# EAGLE design temp (EAGLE 7.2.0)
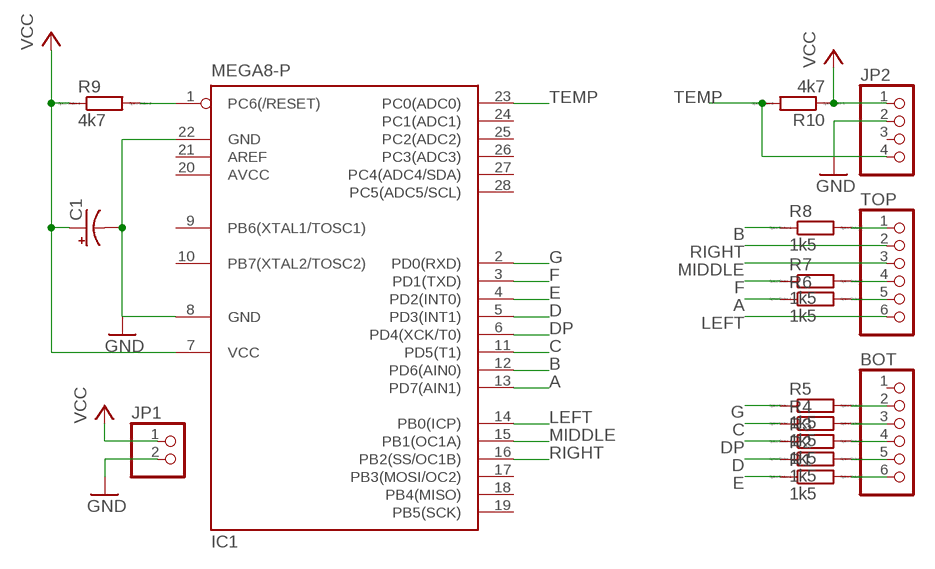
[diagram p0: schematic, sheet 1]

## Parts
BOT  PINHD-1X6  [1X06]
C1  CPOL-US153CLV-0505  [153CLV-0505]
IC1  MEGA8-P  [DIL28-3]
JP1  PINHD-1X2  [1X02]
JP2  PINHD-1X4  [1X04]
R1  1k5  R-EU_R1206  [R1206]
R2  1k5  R-EU_R1206  [R1206]
R3  1k5  R-EU_R1206  [R1206]
R4  1k5  R-EU_R1206  [R1206]
R5  1k5  R-EU_R1206  [R1206]
R6  1k5  R-EU_R1206  [R1206]
R7  1k5  R-EU_R1206  [R1206]
R8  1k5  R-EU_R1206  [R1206]
R9  4k7  R-EU_R1206  [R1206]
R10  4k7  R-EU_R1206  [R1206]
TOP  PINHD-1X6  [1X06]

## Nets
A: IC1.13(PD7(AIN1)) R6.1
B: IC1.12(PD6(AIN0)) R8.1
C: IC1.11(PD5(T1)) R4.1
D: IC1.5(PD3(INT1)) R2.1
DP: IC1.6(PD4(XCK/T0)) R3.1
E: IC1.4(PD2(INT0)) R1.1
F: IC1.3(PD1(TXD)) R7.1
G: IC1.2(PD0(RXD)) R5.1
GND: C1.- IC1.8(GND) IC1.22(GND) JP1.2 JP2.2
LEFT: IC1.14(PB0(ICP)) TOP.6
MIDDLE: IC1.15(PB1(OC1A)) TOP.3
N$1: R8.2 TOP.1
N$2: R7.2 TOP.4
N$3: R6.2 TOP.5
N$4: BOT.2 R5.2
N$5: BOT.3 R4.2
N$6: BOT.4 R3.2
N$7: BOT.5 R2.2
N$8: BOT.6 R1.2
N$9: IC1.1(PC6(/RESET)) R9.2
RIGHT: IC1.16(PB2(SS/OC1B)) TOP.2
TEMP: IC1.23(PC0(ADC0)) JP2.4 R10.2
VCC: C1.+ IC1.7(VCC) JP1.1 JP2.1 R9.1 R10.1
Unconnected: BOT.1 IC1.9(PB6(XTAL1/TOSC1)) IC1.10(PB7(XTAL2/TOSC2)) IC1.17(PB3(MOSI/OC2)) IC1.18(PB4(MISO)) IC1.19(PB5(SCK)) IC1.21(AREF) IC1.24(PC1(ADC1)) IC1.25(PC2(ADC2)) IC1.26(PC3(ADC3)) IC1.27(PC4(ADC4/SDA)) IC1.28(PC5(ADC5/SCL)) JP2.3

## Power pins joined to a net without a drawn wire
AVCC: IC1.20(AVCC)

## Library data of the parts
BOT TOP = pinhead:PINHD-1X6: PIN HEADER
C1 = rcl:CPOL-US: POLARIZED CAPACITOR, American symbol
IC1 = atmel:MEGA8-P: MICROCONTROLLER 8 Kbytes FLASH, 1 kbytes SRAM, 512 bytes EEPROM, USART, 4-channel 10 bit ADC, 2-channel 8 bit ADC Pin compatible with Atmega48, ATMega88, ATMega168 Source: avr.lbr; OC_FARNELL: unknown; OC_NEWARK: unknown
JP1 = pinhead:PINHD-1X2: PIN HEADER
JP2 = pinhead:PINHD-1X4: PIN HEADER
R1-R10 = resistor:R-EU_: RESISTOR, European symbol; SPICEPREFIX: R

## Board
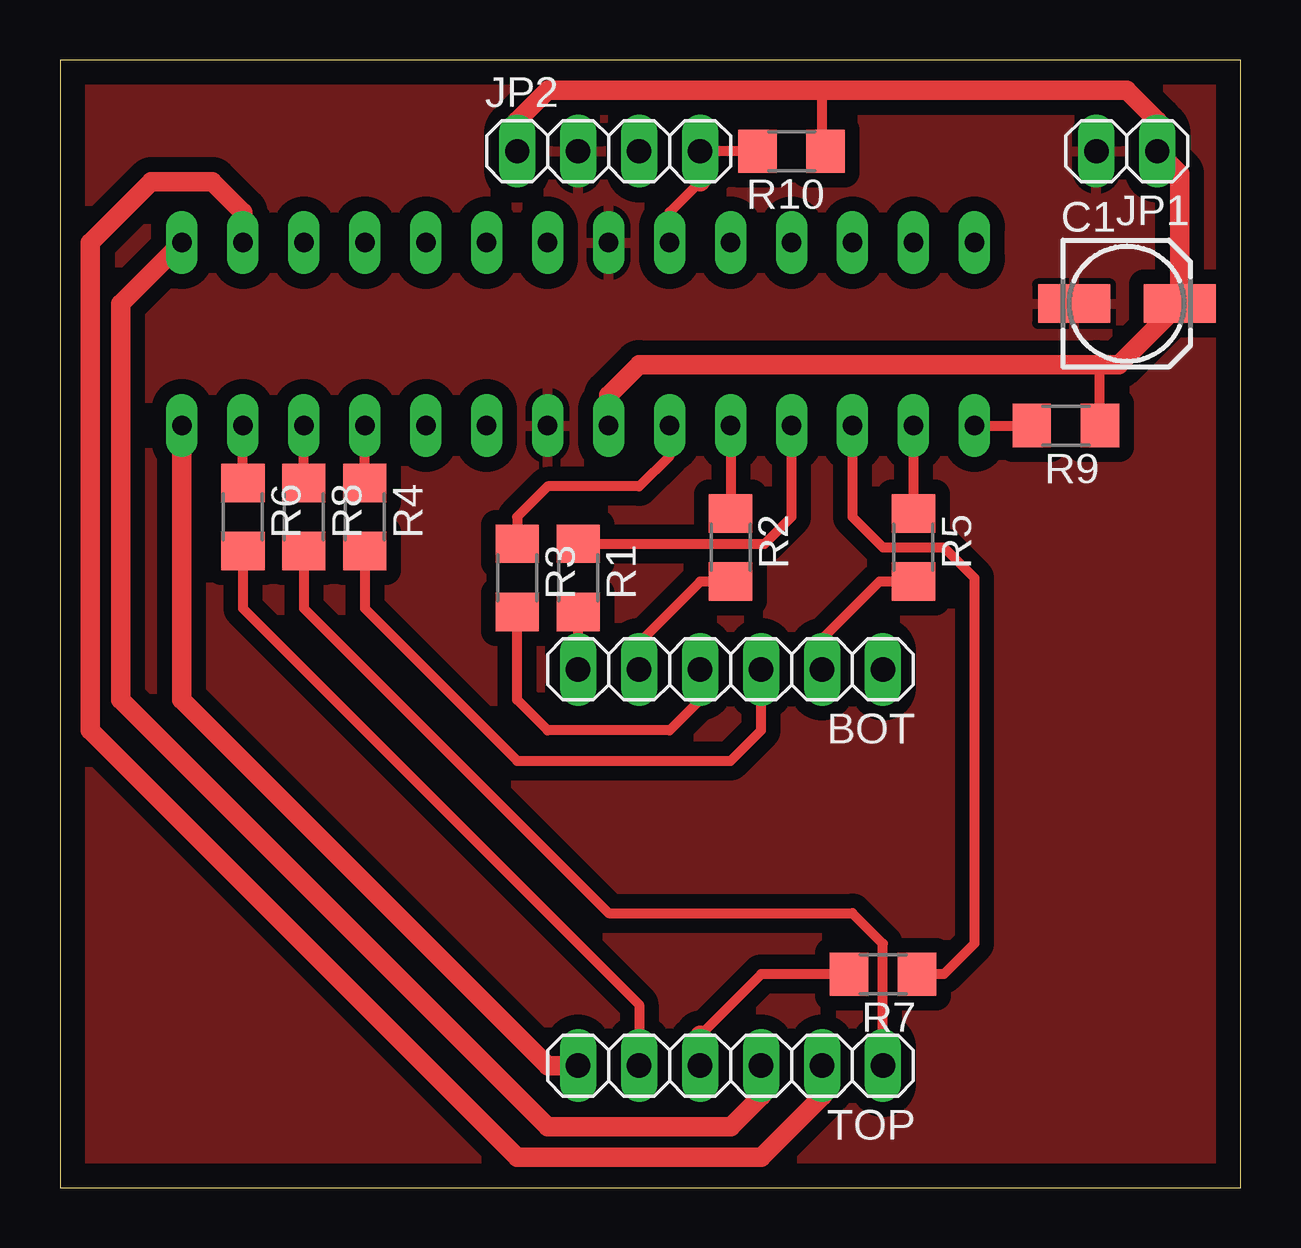
[diagram p1: board, top side]
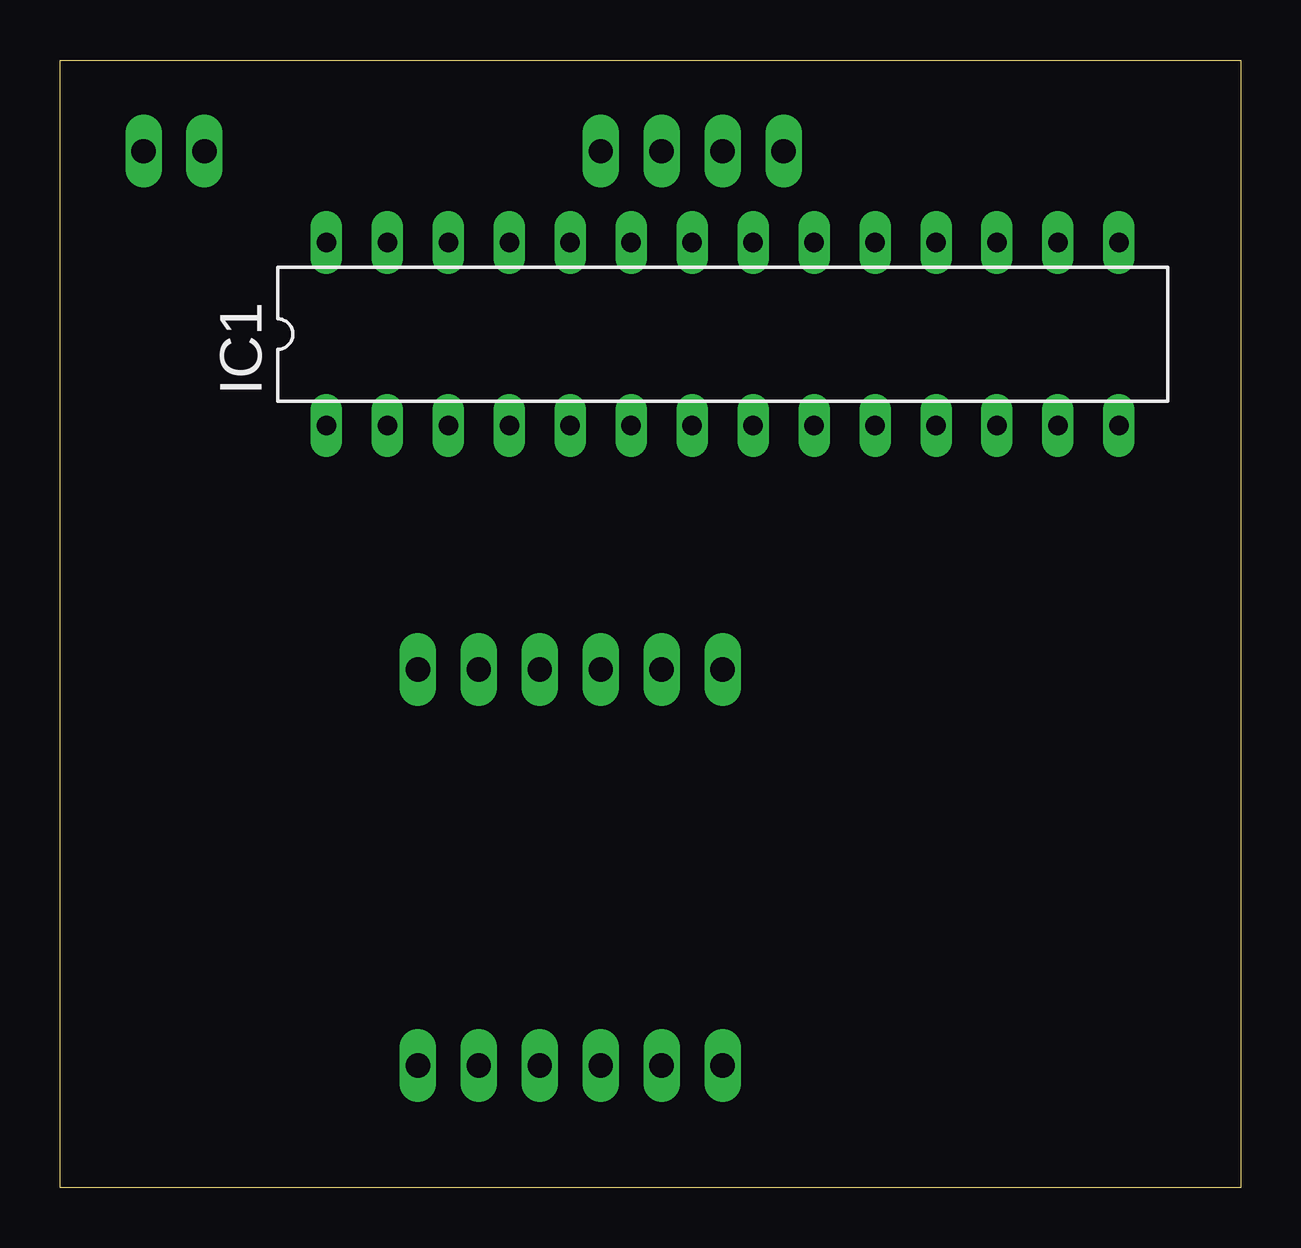
[diagram p2: board, bottom side, seen from below]

Size 49.2 x 46.98 mm. Coordinates in mm from the lower left corner, seen from the top.
Outline: 0,0 49.2,0 49.2,46.98 0,46.98 0,0
Copper layers (1*16): Top 0.035mm / dielectric 1.5mm / Bottom 0.035mm
Design rules "default": minimum track width 10mil, minimum drill 24mil, track to track 8mil, track to pad 8mil, pad to pad 8mil, via to via 8mil, smd to smd 8mil, copper to edge 40mil, drill to drill 8mil, minimum pad ring 10mil, minimum via ring 8mil, stop-mask expansion 4mil, vias tented up to drill 0mil, thermal gap 10mil

### Footprints (pad centres in the part's own frame; a part is rotated, then mirrored left to right if it is on the bottom)
1X06 = drill 1.016 long: 1 -6.35,0; 2 -3.81,0; 3 -1.27,0; 4 1.27,0; 5 3.81,0; 6 6.35,0
153CLV-0505 = smd 3 x 1.6: + 2.2,0; - -2.2,0
DIL28-3 = drill 0.813 long: 1 -16.51,-3.81; 2 -13.97,-3.81; 3 -11.43,-3.81; 4 -8.89,-3.81; 5 -6.35,-3.81; 6 -3.81,-3.81; 7 -1.27,-3.81; 8 1.27,-3.81; 9 3.81,-3.81; 10 6.35,-3.81; 11 8.89,-3.81; 12 11.43,-3.81; 13 13.97,-3.81; 14 16.51,-3.81; 15 16.51,3.81; 16 13.97,3.81; 17 11.43,3.81; 18 8.89,3.81; 19 6.35,3.81; 20 3.81,3.81; 21 1.27,3.81; 22 -1.27,3.81; 23 -3.81,3.81; 24 -6.35,3.81; 25 -8.89,3.81; 26 -11.43,3.81; 27 -13.97,3.81; 28 -16.51,3.81
1X02 = drill 1.016 long: 1 -1.27,0; 2 1.27,0
1X04 = drill 1.016 long: 1 -3.81,0; 2 -1.27,0; 3 1.27,0; 4 3.81,0
R1206 = smd 1.6 x 1.803: 1 -1.422,0; 2 1.422,0

### Placement (x,y rotation side)
BOT  27.94,21.59 180 top
C1  44.45,36.83 0 top
IC1  21.59,35.56 0 bottom
JP1  44.45,43.18 180 top
JP2  22.86,43.18 0 top
R1  21.59,25.4 270 top
R2  27.94,26.67 270 top
R3  19.05,25.4 270 top
R4  12.7,27.94 270 top
R5  35.56,26.67 270 top
R6  7.62,27.94 270 top
R7  34.29,8.89 180 top
R8  10.16,27.94 270 top
R9  41.91,31.75 180 top
R10  30.48,43.18 180 top
TOP  27.94,5.08 180 top

### Tracks (layer width: path | path; a pad name or v marks a point on that pad's centre or on a via)
A
  Top 0.406: R6.1 IC1.13
B
  Top 0.406: R8.1 IC1.12
C
  Top 0.406: R4.1 IC1.11
D
  Top 0.406: IC1.5 R2.1
DP
  Top 0.406: IC1.6 25.4,30.48 24.13,29.21 20.32,29.21 19.05,27.94 R3.1
E
  Top 0.406: R1.1 29.36,26.82 30.48,27.94 IC1.4
F
  Top 0.406: IC1.3 33.02,27.94 34.29,26.67 36.83,26.67 38.1,25.4 38.1,10.16 36.83,8.89 R7.1
G
  Top 0.406: IC1.2 R5.1
GND
  pour Top (isolate 0.61): 0,46.99 49.53,46.99 49.53,0 0,0
LEFT
  Top 0.813: TOP.6 20.32,5.08 5.08,20.32 IC1.14
MIDDLE
  Top 0.813: TOP.3 29.21,3.81 27.94,2.54 20.32,2.54 2.54,20.32 2.54,36.83 IC1.15
N$1
  Top 0.406: R8.2 10.16,24.13 22.86,11.43 33.02,11.43 34.29,10.16 TOP.1
N$2
  Top 0.406: R7.2 29.21,8.89 26.67,6.35
  Top 0.813: 26.67,6.35 TOP.4
N$3
  Top 0.406: R6.2 7.62,24.13 24.13,7.62 TOP.5
N$4
  Top 0.406: R5.2 34.14,25.25 31.75,22.86 BOT.2
N$5
  Top 0.406: R4.2 12.7,24.13 19.05,17.78 27.94,17.78 29.21,19.05 BOT.3
N$6
  Top 0.406: BOT.4 26.67,20.32 25.4,19.05 20.32,19.05 19.05,20.32 R3.2
N$7
  Top 0.406: BOT.5 24.13,22.71 26.67,25.25 R2.2
N$8
  Top 0.406: BOT.6 R1.2
N$9
  Top 0.406: IC1.1 R9.2
RIGHT
  Top 0.813: IC1.16 7.62,40.64 6.35,41.91 3.81,41.91 1.27,39.37 1.27,19.05 19.05,1.27 29.21,1.27 31.75,3.81 TOP.2
TEMP
  Top 0.406: R10.2 JP2.4 | IC1.23 25.4,40.64 26.67,41.91
  Top 0.813: 26.67,41.91 JP2.4
VCC
  Top 0.406: 31.75,43.33 31.75,45.72 | R9.1 43.33,34.14 43.18,34.29
  Top 0.813: IC1.7 22.86,33.02 24.13,34.29 43.18,34.29 44.11,34.29 C1.+ 46.65,42.25 JP1.1 45.72,44.45 44.45,45.72 31.75,45.72 20.32,45.72 19.05,44.45 JP2.1 | 31.75,43.33 R10.1